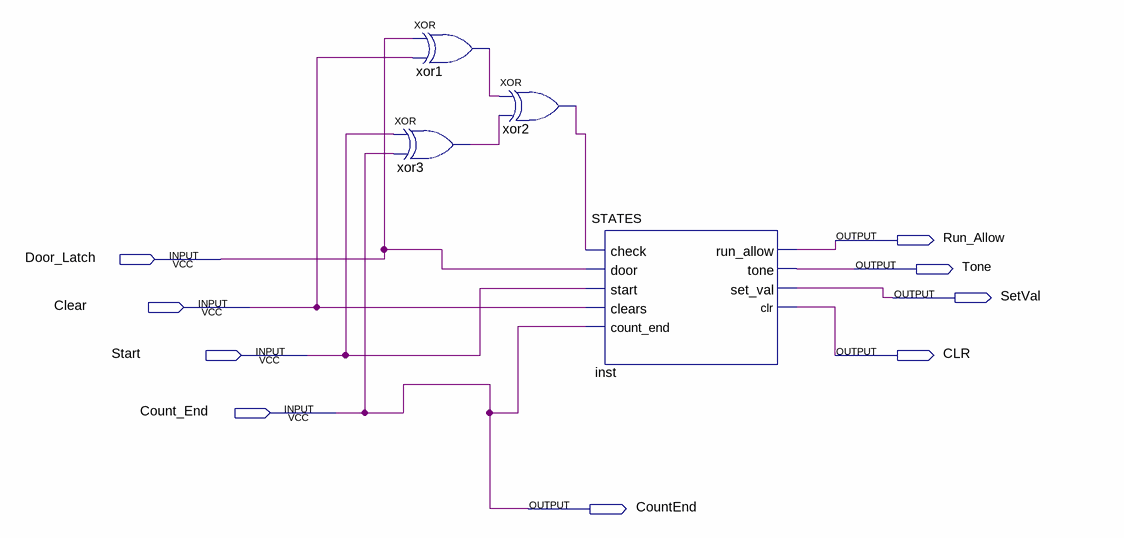
[diagram p0: schematic sheet]
// Quartus schematic Block1.bdf as structural Verilog: 4 symbols, 9 pins
module Block1 (
  input  Door_Latch,
  input  Clear,
  input  Start,
  input  Count_End,
  output Run_Allow,
  output Tone,
  output SetVal,
  output CLR,
  output CountEnd
);

  wire xor1_out, xor2_out, xor3_out;

  xor xor3 (xor3_out, Start, Count_End);
  xor xor1 (xor1_out, Door_Latch, Clear);
  xor xor2 (xor2_out, xor1_out, xor3_out);
  STATES inst (
    .check(xor2_out), .door(Door_Latch), .start(Start), .clears(Clear), .count_end(Count_End),
    .run_allow(Run_Allow), .tone(Tone), .set_val(SetVal), .clr(CLR));

  assign CountEnd = Count_End;
endmodule
